# EAGLE design Fritzen_5110LCD_r00 (EAGLE 7.5.0)
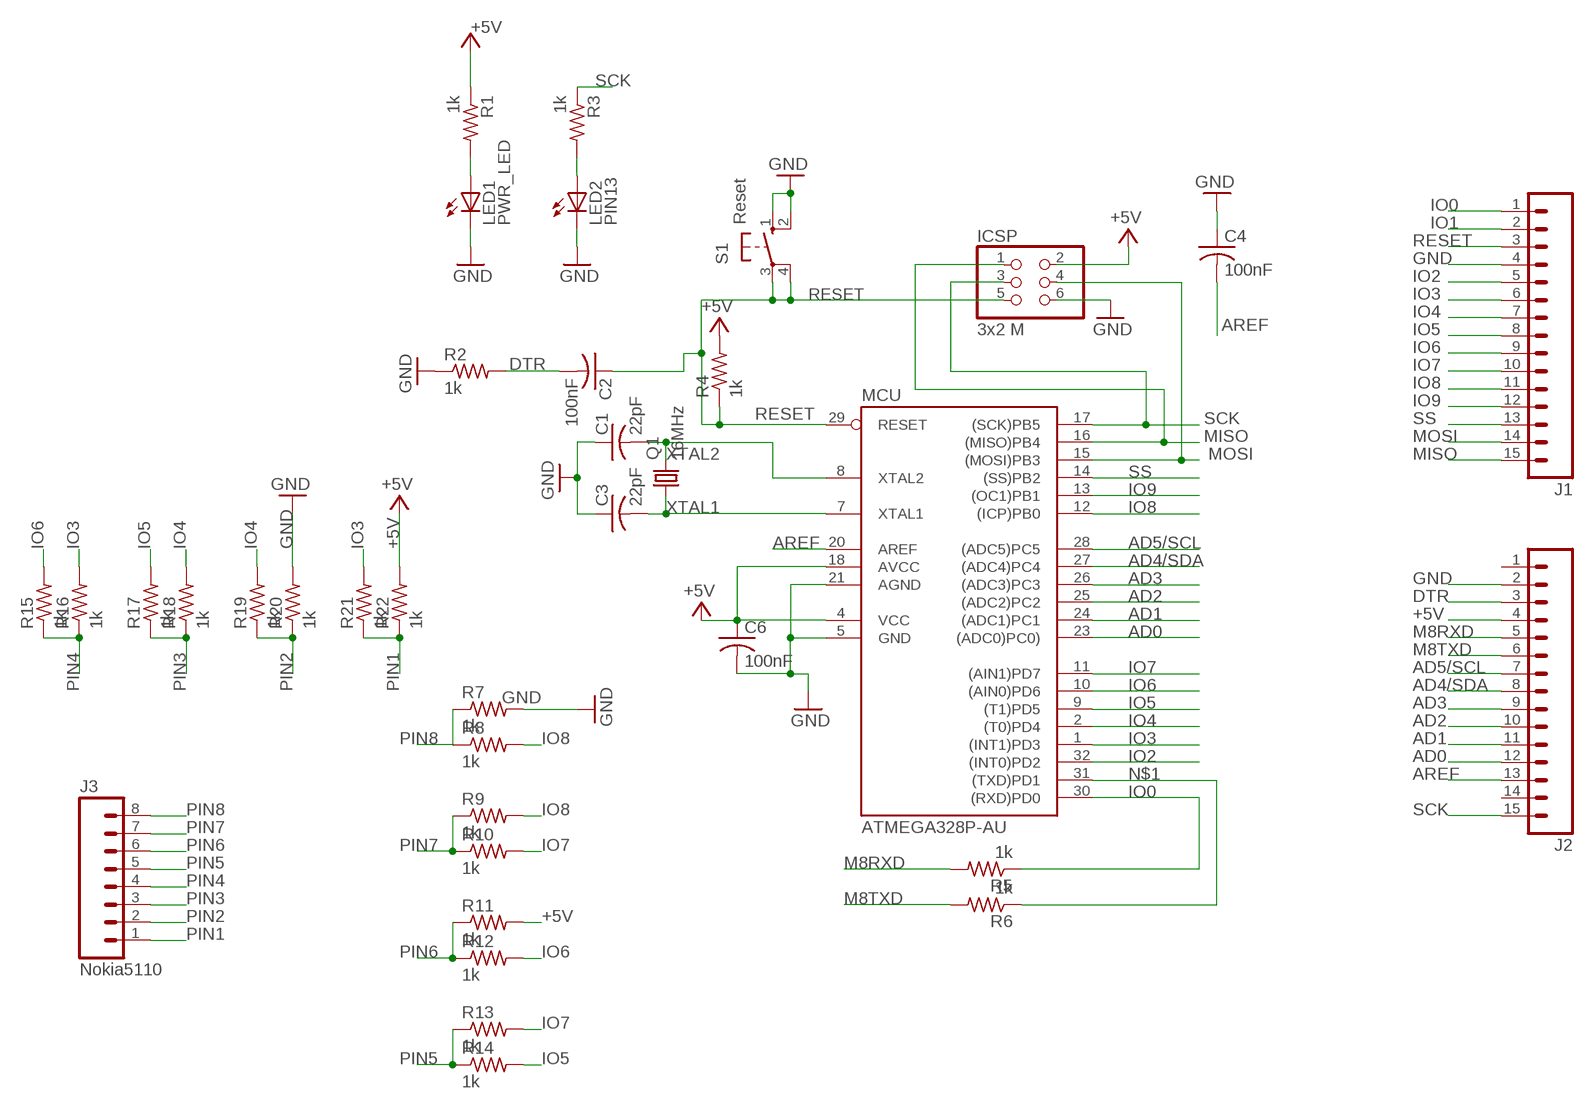
[diagram p0: schematic, sheet 1]

## Parts
C1  22pF  C-USC0805  [C0805]
C2  100nF  C-USC0805  [C0805]
C3  22pF  C-USC0805  [C0805]
C4  100nF  C-USC0805  [C0805]
C6  100nF  C-USC0805  [C0805]
ICSP  3x2 M  PINHD-2X3  [2X03]
J1  M15  [1X15]
J2  M15  [1X15]
J3  Nokia5110  M08SILK_FEMALE_PTH  [1X08]
LED1  PWR_LED  LEDCHIPLED_0805  [CHIPLED_0805]
LED2  PIN13  LEDCHIPLED_0805  [CHIPLED_0805]
MCU  ATMEGA328P-AU  [TQFP32-08]
Q1  16MHz  CRYSTALHC49S  [HC49/S]
R1  1k  R-US_M0805  [M0805]
R2  1k  R-US_M0805  [M0805]
R3  1k  R-US_M0805  [M0805]
R4  1k  R-US_M0805  [M0805]
R5  1k  R-US_M0805  [M0805]
R6  1k  R-US_M0805  [M0805]
R7  1k  R-US_M0805  [M0805]
R8  1k  R-US_M0805  [M0805]
R9  1k  R-US_M0805  [M0805]
R10  1k  R-US_M0805  [M0805]
R11  1k  R-US_M0805  [M0805]
R12  1k  R-US_M0805  [M0805]
R13  1k  R-US_M0805  [M0805]
R14  1k  R-US_M0805  [M0805]
R15  1k  R-US_M0805  [M0805]
R16  1k  R-US_M0805  [M0805]
R17  1k  R-US_M0805  [M0805]
R18  1k  R-US_M0805  [M0805]
R19  1k  R-US_M0805  [M0805]
R20  1k  R-US_M0805  [M0805]
R21  1k  R-US_M0805  [M0805]
R22  1k  R-US_M0805  [M0805]
S1  Reset  10-XX  [B3F-10XX]

## Nets
+5V [usbvcc]: C6.1 ICSP.2 J2.4 MCU.4(VCC) MCU.18(AVCC) R1.1 R4.2 R11.2 R22.2
AD0: J2.12 MCU.23((ADC0)PC0))
AD1: J2.11 MCU.24((ADC1)PC1)
AD2: J2.10 MCU.25((ADC2)PC2)
AD3: J2.9 MCU.26((ADC3)PC3)
AD4/SDA: J2.8 MCU.27((ADC4)PC4)
AD5/SCL: J2.7 MCU.28((ADC5)PC5)
AREF [aref]: C4.2 J2.13 MCU.20(AREF)
DTR: C2.2 J2.3 R2.2
GND [gnd]: C1.1 C3.1 C4.1 C6.2 ICSP.6 J1.4 J2.2 LED1.C LED2.C MCU.5(GND) MCU.21(AGND) R2.1 R7.2 R20.2 S1.1(S) S1.2(S1)
IO0: J1.1 MCU.30((RXD)PD0) R5.1
IO1: J1.2 R6.1
IO2: J1.5 MCU.32((INT0)PD2)
IO3: J1.6 MCU.1((INT1)PD3) R16.2 R21.2
IO4: J1.7 MCU.2((T0)PD4) R18.2 R19.2
IO5: J1.8 MCU.9((T1)PD5) R14.2 R17.2
IO6: J1.9 MCU.10((AIN0)PD6) R12.2 R15.2
IO7: J1.10 MCU.11((AIN1)PD7) R10.2 R13.2
IO8: J1.11 MCU.12((ICP)PB0) R8.2 R9.2
IO9: J1.12 MCU.13((OC1)PB1)
M8RXD: J2.5 R5.2
M8TXD: J2.6 R6.2
MISO: ICSP.1 J1.15 MCU.16((MISO)PB4)
MOSI: ICSP.4 J1.14 MCU.15((MOSI)PB3)
N$1: MCU.31((TXD)PD1)
N$2: LED2.A R3.2
N$3: LED1.A R1.2
PIN1: J3.1 R21.1 R22.1
PIN2: J3.2 R19.1 R20.1
PIN3: J3.3 R17.1 R18.1
PIN4: J3.4 R15.1 R16.1
PIN5: J3.5 R13.1 R14.1
PIN6: J3.6 R11.1 R12.1
PIN7: J3.7 R9.1 R10.1
PIN8: J3.8 R7.1 R8.1
RESET: C2.1 ICSP.5 J1.3 MCU.29(RESET) R4.1 S1.3(P) S1.4(P1)
SCK: ICSP.3 J2.15 MCU.17((SCK)PB5) R3.1
SS: J1.13 MCU.14((SS)PB2)
XTAL1: C3.2 MCU.7(XTAL1) Q1.1
XTAL2: C1.2 MCU.8(XTAL2) Q1.2
Unconnected: J2.1 J2.14

## Library data of the parts
C1-C4 C6 = adafruit:C-US: CAPACITOR, American symbol
ICSP = SmartPrj:PINHD-2X3: PIN HEADER
J1 J2 = SparkFun-Connectors:M15: Header 15 Standard 15-pin 0.1" header. Use with straight break away headers (SKU : PRT-00116), right angle break away headers (PRT-00553), swiss pins (PRT-00743), machine pins (PRT-00117), and female headers (PRT-00115).
J3 = SparkFun-Connectors:M08: Header 8 Standard 8-pin 0.1" header. Use with straight break away headers (SKU : PRT-00116), right angle break away headers (PRT-00553), swiss pins (PRT-00743), machine pins (PRT-00117), and female headers (PRT-00115).; PROD_ID: CONN-08438
LED1 LED2 = adafruit:LED: LED OSRAM: - CHIPLED LG R971, LG N971, LY N971, LG Q971, LY Q971, LO R971, LY R971 LH N974, LH R974 LS Q976, LO Q976, LY Q976 LO Q996 - Hyper CHIPLED LW Q18S LB Q993, LB Q99A, LB R99A - SideLED LS A670, LO A670, LY A670, LG A670, LP A670 LB A673, LV A673, LT A673, LW A673 LH A674 LY A675 LS A676, LA A676, LO A676, LY A676, LW A676 LS A679, LY A679, LG A679 - Hyper Micro SIDELED® LS Y876, LA Y876, LO Y876, LY Y876 LT Y87S - SmartLED LW L88C, LW L88S LB L89C, LB L89S, LG L890 LS L89K, LO L89K, LY L89K LS L896, LA L896, LO L896, LY L896 - TOPLED LS T670, LO T670, LY T670, LG T670, LP T670 LSG T670, LSP T670, LSY T670, LOP T670, LYG T670 LG T671, LOG T671, LSG T671 LB T673, LV T673, LT T673, LW T673 LH T674 LS T676, LA T676, LO T676, LY T676, LB T676, LH T676, LSB T676, LW T676 LB T67C, LV T67C, LT T67C, LS T67K, LO T67K, LY T67K, LW E67C LS E67B, LA E67B, LO E67B, LY E67B, LB E67C, LV E67C, LT E67C LW T67C LS T679, LY T679, LG T679 LS T770, LO T770, LY T770, LG T770, LP T770 LB T773, LV T773, LT T773, LW T773 LH T774 LS E675, LA E675, LY E675, LS T675 LS T776, LA T776, LO T776, LY T776, LB T776 LHGB T686 LT T68C, LB T68C - Hyper Mini TOPLED® LB M676 - Mini TOPLED Santana® LG M470 LS M47K, LO M47K, LY M47K Source: http://www.osram.convergy.de/
MCU = SmartPrj:ATMEGA328P-: MICROCONTROLLER 4 Kbytes FLASH 128 bytes SRAM 256 bytes EEPROM UART 6-channel 10 bit ADC
Q1 = crystal:CRYSTAL: CRYSTAL; OC_FARNELL: 1667008; OC_NEWARK: unknown
R1-R22 = adafruit:R-US_: RESISTOR, American symbol
S1 = switch-omron:10-XX: OMRON SWITCH; MPN: B3F-1000; OC_FARNELL: 176432; OC_NEWARK: 36M3542

## Net classes
0 default: width 0.254 mm, clearance 0.254 mm
1 power: width 0.61 mm, drill 0.61 mm, clearance 0.254 mm
2 gnd: width 0.305 mm, drill 0.559 mm, clearance 0.254 mm
3 usbvcc: width 0.508 mm, drill 0.61 mm, clearance 0.254 mm
4 aref: width 0.406 mm, drill 0.61 mm, clearance 0.254 mm

## Board
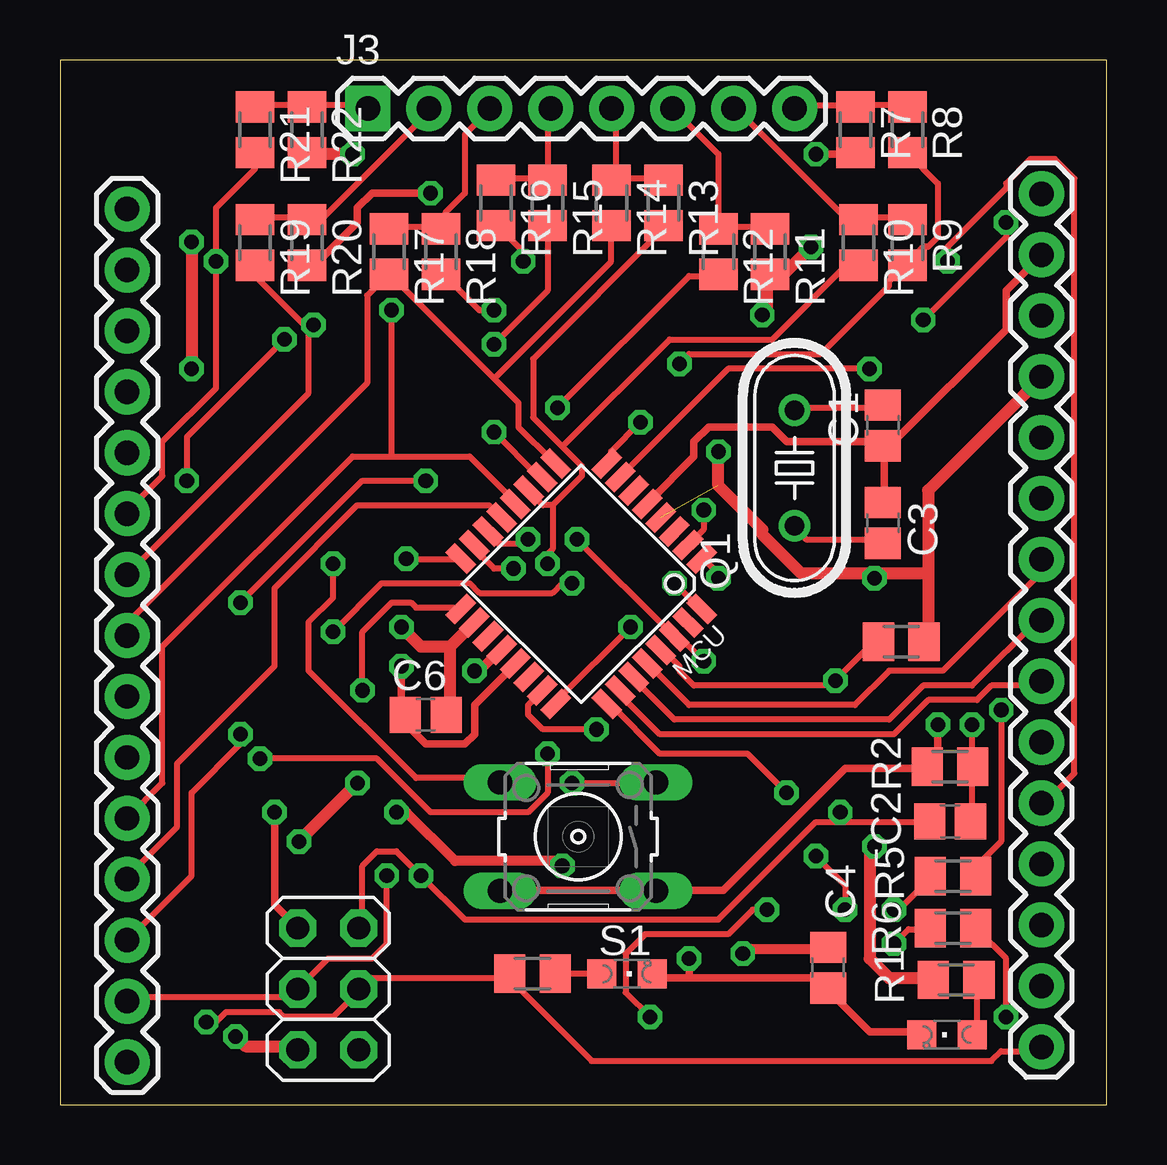
[diagram p1: board, top side]
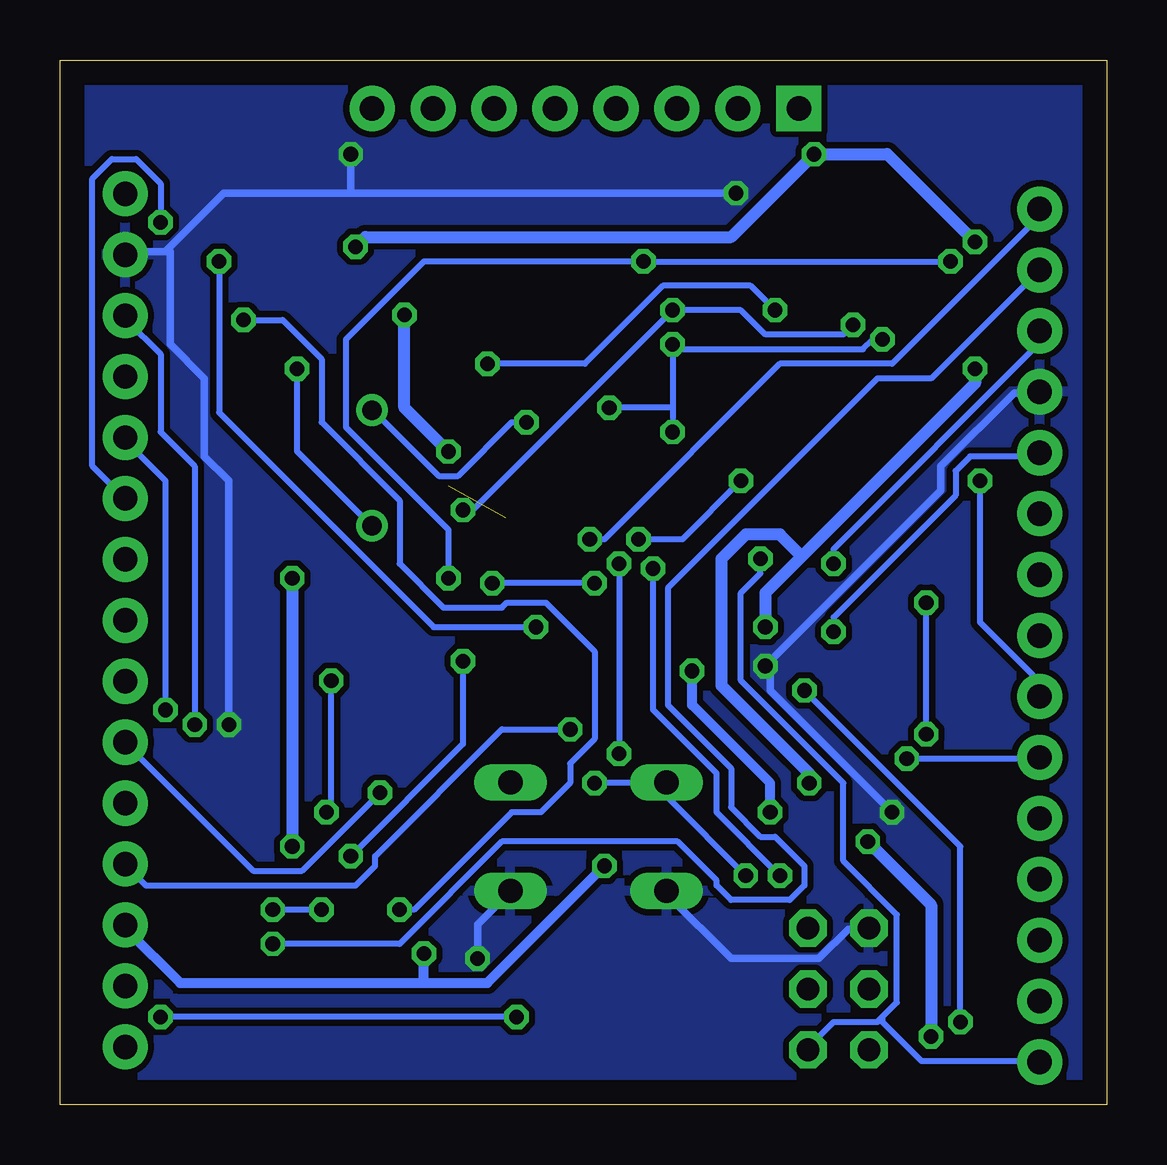
[diagram p2: board, bottom side, seen from below]

Size 43.61 x 43.55 mm. Coordinates in mm from the lower left corner, seen from the top.
Outline: 0,0 43.61,0 43.61,43.55 0,43.55 0,0
Copper layers (1*16): Top 0.035mm / dielectric 1.5mm / Bottom 0.035mm
Design rules "default": minimum track width 10mil, minimum drill 24mil, track to track 8mil, track to pad 8mil, pad to pad 8mil, via to via 8mil, smd to smd 8mil, copper to edge 40mil, drill to drill 8mil, minimum pad ring 10mil, minimum via ring 8mil, stop-mask expansion 4mil, vias tented up to drill 0mil, thermal gap 10mil

### Footprints (pad centres in the part's own frame; a part is rotated, then mirrored left to right if it is on the bottom)
C0805 = smd 1.3 x 1.5: 1 -0.85,0; 2 0.85,0
2X03 = drill 0.95 pad 1.55 octagon: 1 -2.54,-1.27; 2 -2.54,1.27; 3 0,-1.27; 4 0,1.27; 5 2.54,-1.27; 6 2.54,1.27
1X15 = drill 1.016 pad 1.88: 1 0,0; 2 2.54,0; 3 5.08,0; 4 7.62,0; 5 10.16,0; 6 12.7,0; 7 15.24,0; 8 17.78,0; 9 20.32,0; 10 22.86,0; 11 25.4,0; 12 27.94,0; 13 30.48,0; 14 33.02,0; 15 35.56,0
1X08 = drill 1.016 pad 1.88 square: 1 0,0 | drill 1.016 pad 1.88: 2 2.54,0; 3 5.08,0; 4 7.62,0; 5 10.16,0; 6 12.7,0; 7 15.24,0; 8 17.78,0
CHIPLED_0805 = smd 1.2 x 1.2: A 0,-1.05; C 0,1.05
TQFP32-08 = smd 1.27 x 0.559: 1 -4.293,2.8; 2 -4.293,2; 3 -4.293,1.2; 4 -4.293,0.4; 5 -4.293,-0.4; 6 -4.293,-1.2; 7 -4.293,-2; 8 -4.293,-2.8; 17 4.293,-2.8; 18 4.293,-2; 19 4.293,-1.2; 20 4.293,-0.4; 21 4.293,0.4; 22 4.293,1.2; 23 4.293,2; 24 4.293,2.8 | smd 0.559 x 1.27: 9 -2.8,-4.293; 10 -2,-4.293; 11 -1.2,-4.293; 12 -0.4,-4.293; 13 0.4,-4.293; 14 1.2,-4.293; 15 2,-4.293; 16 2.8,-4.293; 25 2.8,4.293; 26 2,4.293; 27 1.2,4.293; 28 0.4,4.293; 29 -0.4,4.293; 30 -1.2,4.293; 31 -2,4.293; 32 -2.8,4.293
HC49/S = drill 0.813: 1 -2.413,0; 2 2.413,0
M0805 = smd 1.3 x 1.6: 1 -0.95,0; 2 0.95,0
B3F-10XX = drill 1.016 long: 1 -3.251,2.261; 2 3.251,2.261; 3 -3.251,-2.261; 4 3.251,-2.261

### Placement (x,y rotation side)
C1  34.29,28.32 90 top
C2  37.08,11.81 0 top
C3  34.29,24.26 270 top
C4  32,5.71 90 top
C6  15.24,16.26 180 top
ICSP  11.18,4.83 90 top
J1  2.79,37.34 270 top
J2  40.89,37.97 270 top
J3  12.83,41.53 0 top
LED1  36.96,2.92 90 top
LED2  23.62,5.46 270 top
MCU  21.72,21.72 225 top
Q1  30.61,26.54 90 top
R1  37.34,5.21 0 top
R2  37.08,14.1 0 top
R3  19.68,5.46 0 top
R4  35.05,19.3 0 top
R5  37.21,9.53 0 top
R6  37.21,7.37 0 top
R7  33.15,40.64 270 top
R8  35.31,40.64 270 top
R9  35.31,35.94 270 top
R10  33.27,35.94 270 top
R11  29.59,35.56 270 top
R12  27.43,35.56 270 top
R13  25.15,37.59 270 top
R14  22.99,37.59 270 top
R15  20.32,37.59 270 top
R16  18.16,37.59 270 top
R17  13.72,35.56 270 top
R18  15.88,35.56 270 top
R19  8.13,35.94 270 top
R20  10.29,35.94 270 top
R21  8.13,40.64 270 top
R22  10.29,40.64 270 top
S1  21.59,11.18 180 top

### Tracks (layer width: path | path; a pad name or v marks a point on that pad's centre or on a via)
+5V  (via drill 0.61)  (1 unrouted)
  Top 0.508: 16.26,19.1 17.07,19.91 MCU.18 | 16.26,19.1 16.26,16.26 C6.1 | 36.17,22.15 36.17,25.6 40.84,30.28 J2.4 | 36.17,22.15 36.17,19.3 R4.2 | v29.26,32.92 29.46,33.12 29.46,34.54 R11.2 29.67,34.75 30.28,34.75 v31.29,35.76 | v27.43,27.23 27.43,25.81 29.26,23.98 29.26,23.77 30.89,22.15 33.93,22.15 | 36.17,22.15 33.93,22.15 | v12.19,39.62 10.36,39.62 R22.2 | v33.93,10.77 33.73,10.57 33.73,6.1 34.54,5.28 36.37,5.28 R1.1 | v33.93,21.95 33.93,22.15 | 16.26,19.1 15.04,19.1 v14.22,19.91 | v5.49,35.97 v5.49,30.68 | v7.32,2.85 7.72,2.44 9.75,2.44 ICSP.2 | v12.39,13.41 v9.96,10.97
  Bottom 0.508: v29.26,32.92 29.26,29.06 v27.43,27.23 | v31.29,35.76 30.89,36.17 15.65,36.17 v12.19,39.62 9.14,39.62 v5.49,35.97 | v33.93,21.95 v33.93,10.77 | v14.22,19.91 14.22,21.34 12.7,22.86 | 12.7,22.86 5.49,30.07 v5.49,30.68 | v7.32,2.85 7.32,8.33 v9.96,10.97 | v12.39,13.41 12.39,13.82 16.05,17.48 16.05,22.76 15.04,23.77 13.61,23.77 12.7,22.86
AD0  (via drill 0.61)
  Top 0.254: v22.35,15.65 20.12,15.65 19.51,16.26 19.51,16.66 19.91,17.07 MCU.23
  Bottom 0.254: v22.35,15.65 25.2,15.65 30.48,10.36 30.48,9.96 31.29,9.14 40.03,9.14 40.84,9.96 J2.12
AD1  (via drill 0.61)
  Top 0.254: v23.77,19.91 20.73,16.87 MCU.24 | v36.98,35.15 36.98,35.76 39.42,38.2 39.42,38.41 40.44,39.42 41.45,39.42 42.27,38.61 42.27,13.82 41.05,12.6 J2.11
  Bottom 0.254: v23.77,19.91 28.04,19.91 36.98,28.85 v36.98,35.15
AD2  (via drill 0.61)
  Top 0.254: v30.28,13.01 28.65,14.63 24.99,14.63 22.96,16.66 MCU.25
  Bottom 0.254: v30.28,13.01 33.53,9.75 35.56,9.75 40.84,15.04 J2.10
AD3
  Top 0.254: MCU.26 23.37,17.07 24.99,15.44 34.75,15.44 36.17,16.87 38.2,16.87 38.81,17.48 40.84,17.48 J2.9
AD4/SDA
  Top 0.254: MCU.27 23.98,17.68 25.6,16.05 34.54,16.05 35.97,17.48 38,17.48 40.84,20.32 J2.8
AD5/SCL
  Top 0.254: MCU.28 24.59,18.29 26.21,16.66 33.12,16.66 34.54,18.09 36.78,18.09 40.84,22.15 40.84,22.55 J2.7
AREF  (via drill 0.61)
  Top 0.406: v17.27,18.09 17.48,18.09 18.29,18.9 MCU.20 | v14.02,12.19 14.43,12.19 16.46,10.16 20.73,10.16 v20.93,9.96 | v28.45,6.3 28.65,6.5 31.9,6.5 C4.2
  Bottom 0.406: v17.27,18.09 17.27,16.66 14.02,13.41 v14.02,12.19 | v20.93,9.96 25.81,5.08 28.45,5.08 | 28.45,5.08 38.61,5.08 40.84,7.32 J2.13 | 28.45,5.08 v28.45,6.3
DTR  (via drill 0.61)
  Top 0.254: C2.2 38,11.99 38,14.02 R2.2 38,14.22 v38,15.85
  Bottom 0.254: v38,15.85 38,26.62 39.42,28.04 39.42,31.29 40.84,32.72 J2.3
GND  (via drill 0.61)
  Top 0.305: MCU.5 24.59,25.2 26.42,27.03 26.42,27.64 27.03,28.25 29.67,28.25 30.28,27.64 34.14,27.64 C1.1 | C3.1 34.34,25.2 34.34,27.43 C1.1 | v15.44,38 13.01,38 12.39,37.39 12.39,36.78 10.77,35.15 10.36,35.15 R20.2 | v31.5,39.62 33.12,39.62 R7.2 | C1.1 34.34,27.64 34.75,27.64 39.42,32.31 39.42,33.93 40.84,35.36 J2.2 | MCU.21 18.9,18.29 17.27,16.66 17.27,15.44 16.87,15.04 15.24,15.04 14.43,15.85 14.43,16.26 C6.2 14.22,16.26 v14.22,18.29 | 26.21,5.28 31.5,5.28 31.9,4.88 C4.1 32.11,4.67 33.73,3.05 35.76,3.05 LED1.C | 26.21,5.28 24.79,5.28 LED2.C | S1.2 18.49,8.94 24.79,8.94 S1.1 24.99,8.94 27.64,8.94 32.72,14.02 35.97,14.02 R2.1 36.17,14.22 36.58,14.63 v36.58,15.85 | v26.21,6.1 26.21,5.28 | v8.94,12.19 8.94,8.33 ICSP.6
  Bottom 0.305: 31.5,38 36.78,38 39.12,35.66 | 31.5,38 v15.44,38 | 39.12,35.66 39.22,35.56 40.84,35.56 J2.2 | 31.5,38 v31.5,39.62 | J1.4 2.85,29.67 3.86,29.67 6.91,26.62 6.91,25.6 v14.22,18.29 14.02,18.29 14.02,17.27 v8.94,12.19 | ICSP.6 9.96,7.32 10.77,7.32 11.99,6.1 15.65,6.1 18.29,8.74 S1.2 | v26.21,6.1 26.21,7.52 24.99,8.74 S1.1 | v36.58,15.85 36.58,26.01 37.59,27.03 37.59,30.28 39.01,31.7 39.01,35.56 39.12,35.66
  pour Bottom: 0,0 43.56,0 43.56,43.56 0,43.56
IO0  (via drill 0.61)
  Top 0.254: v21.54,23.57 25.4,19.71 MCU.30 25.6,19.71 v26.82,18.49 | v34.75,8.13 34.95,8.13 36.17,9.35 R5.1 | v32.72,8.13 32.72,9.14 v31.5,10.36
  Bottom 0.254: v21.54,23.57 20.93,23.57 13.61,30.89 8.94,30.89 2.64,37.19 J1.1 | v32.72,8.13 v34.75,8.13 | v31.5,10.36 26.82,15.04 v26.82,18.49
IO1  (via drill 0.61)
  Top 0.254: v34.75,6.71 35.36,7.32 36.17,7.32 R6.1
  Bottom 0.254: v34.75,6.71 29.46,6.71 25.2,10.97 17.88,10.97 16.26,9.35 16.26,9.14 15.65,8.53 13.21,8.53 12.6,9.14 12.6,9.96 13.82,11.18 14.43,11.18 15.65,12.39 15.65,14.02 18.29,16.66 18.29,21.54 9.55,30.28 7.32,30.28 J1.2
IO2  (via drill 0.61)
  Top 0.254: v25.6,21.74 26.62,20.73 MCU.32 | v21.34,21.74 20.93,21.74 20.52,21.34 17.48,21.34 17.07,21.74 13.41,21.74 v11.38,19.71
  Bottom 0.254: v21.34,21.74 v25.6,21.74 | v11.38,19.71 11.38,20.32 6.3,25.4 6.3,26.42 5.69,27.03 2.85,27.03 J1.5
IO3  (via drill 0.61)
  Top 0.254: R21.2 8.13,39.01 6.5,37.39 v6.5,35.15 6.5,29.87 4.27,27.64 4.27,26.21 2.85,24.79 J1.6 | v27.43,21.95 27.43,22.15 26.82,22.76 MCU.1 | v19.3,35.15 19.3,35.56 18.29,36.58 R16.2
  Bottom 0.254: v27.43,21.95 27.43,23.98 31.7,28.25 31.7,31.9 28.45,35.15 v19.3,35.15 v6.5,35.15
IO4  (via drill 0.61)
  Top 0.254: v26.82,24.79 26.82,23.98 26.21,23.37 MCU.2 | v18.09,33.12 17.48,33.12 16.05,34.54 R18.2 | R19.2 8.13,34.54 10.36,32.31 | 10.36,32.31 10.36,29.67 J1.7 | 10.36,32.31 v10.57,32.51
  Bottom 0.254: v26.82,24.79 26.42,24.79 v18.09,33.12 15.24,33.12 14.22,32.11 10.97,32.11 v10.57,32.51
IO5
  Top 0.254: 18.09,30.28 13.82,34.54 R17.2 13.61,34.54 12.8,33.73 12.8,30.07 2.85,20.12 2.85,19.71 J1.8 | 18.09,30.28 19.1,29.26 19.1,28.25 20.52,26.82 MCU.9 | 18.09,30.28 22.96,35.15 22.96,36.58 R14.2
IO6  (via drill 0.61)
  Top 0.254: v18.09,28.04 19.91,26.21 MCU.10 | v18.09,31.7 20.32,33.93 R15.2 | v20.73,29.06 26.21,34.54 27.43,34.54 R12.2 | v5.28,26.01 5.28,27.84 v9.35,31.9
  Bottom 0.254: 18.09,31.5 18.09,29.06 | 18.09,29.06 v18.09,28.04 | 18.09,29.06 v20.73,29.06 | v5.28,26.01 5.28,20.12 2.85,17.68 2.85,17.07 J1.9 | v9.35,31.9 9.75,31.9 10.16,31.5 18.09,31.5 | 18.09,31.5 v18.09,31.7
IO7  (via drill 0.61)
  Top 0.254: 20.52,24.99 20.12,24.99 19.71,25.4 MCU.11 | 20.52,24.99 21.74,26.21 21.74,26.62 20.93,27.43 | 20.93,27.43 19.71,28.65 19.71,31.09 25.2,36.58 R13.2 | 20.93,27.43 25.4,31.9 29.67,31.9 32.72,34.95 33.12,34.95 R10.2 | v8.33,14.43 13.21,14.43 15.44,12.19 19.51,12.19 20.32,13.01 v20.32,14.63 | v20.32,22.55 20.32,22.96 20.52,23.16 20.52,24.99
  Bottom 0.254: v8.33,14.43 2.85,14.43 J1.10 | v20.32,22.55 v20.32,14.63
IO8  (via drill 0.61)
  Top 0.254: R8.2 35.36,39.62 36.58,38.41 36.58,36.17 36.17,35.76 35.97,35.76 35.36,35.15 R9.2 35.15,34.95 34.54,34.34 34.54,34.14 31.7,31.29 26.21,31.29 v25.81,30.89 | 13.82,27.03 12.19,27.03 4.27,19.1 4.27,13.41 J1.11 | 13.82,27.03 17.07,27.03 18.9,25.2 MCU.12 | 13.82,27.03 v13.82,33.12
  Bottom 0.254: v25.81,30.89 21.74,30.89 18.49,34.14 14.83,34.14 v13.82,33.12
IO9
  Top 0.254: MCU.13 18.29,24.59 17.88,24.99 12.39,24.99 8.94,21.54 8.94,18.29 4.88,14.22 4.88,11.58 2.85,9.55 J1.12
M8RXD  (via drill 0.61)
  Top 0.254: v39.22,16.46 39.22,10.97 38.2,9.96 38.2,9.55 R5.2
  Bottom 0.254: v39.22,16.46 39.22,26.01 40.84,27.64 J2.5
M8TXD  (via drill 0.61)
  Top 0.254: v39.42,3.66 39.42,6.1 38.2,7.32 R6.2 | v24.59,3.66 23.57,4.67 23.57,6.3 24.38,7.11 27.84,7.11 28.85,8.13 v29.46,8.13 | v35.97,32.72 39.42,36.17 v39.42,36.78
  Bottom 0.254: v24.59,3.66 v39.42,3.66 | v29.46,8.13 28.85,8.13 24.79,12.19 23.57,12.19 22.35,13.41 22.35,14.22 21.34,15.24 21.34,18.9 23.37,20.93 24.99,20.93 25.2,20.73 27.64,20.73 29.46,22.55 29.46,25.2 32.72,28.45 32.72,31.09 34.34,32.72 v35.97,32.72 | v39.42,36.78 39.42,38.41 40.44,39.42 41.45,39.42 42.27,38.61 42.27,26.62 41.05,25.4 J2.6
MISO  (via drill 0.61)
  Top 0.254: v14.43,22.76 16.66,22.76 MCU.16
  Bottom 0.254: v14.43,22.76 14.43,22.15 15.24,21.34 15.24,17.68 10.97,13.41 10.97,10.16 8.74,7.92 8.74,4.27 9.35,3.66 | 9.35,3.66 9.55,3.45 11.38,3.45 12.39,2.44 ICSP.1 | 9.35,3.66 9.35,3.45 7.72,1.83 2.85,1.83 J1.15
MOSI  (via drill 0.61)
  Top 0.254: v18.9,22.35 18.09,22.35 17.27,23.16 MCU.15 | v13.61,9.55 13.61,6.71 13.01,6.1 11.18,6.1 ICSP.4 9.55,4.47 2.85,4.47 J1.14
  Bottom 0.254: v18.9,22.35 18.9,16.46 16.26,13.82 16.26,12.19 v13.61,9.55
N$2
  Top 0.254: LED2.A 22.55,5.49 20.73,5.49 R3.2
N$3
  Top 0.254: LED1.A 38.2,3.05 38.2,5.08 R1.2
PIN1
  Top 0.254: R21.1 8.13,41.66 10.16,41.66 R22.1 10.36,41.66 12.8,41.66 J3.1
PIN2
  Top 0.254: R19.1 8.13,36.98 10.16,36.98 R20.1 10.36,36.98 10.97,36.98 15.44,41.45 J3.2
PIN3
  Top 0.254: R17.1 13.82,36.58 15.85,36.58 R18.1 16.05,36.58 16.05,37.19 16.87,38 16.87,40.44 17.88,41.45 J3.3
PIN4
  Top 0.254: 20.32,38.61 18.29,38.61 R16.1 | 20.32,38.61 20.32,41.45 J3.4 | 20.32,38.61 R15.1
PIN5
  Top 0.254: 23.16,38.61 24.99,38.61 R13.1 | 23.16,38.61 23.16,41.45 J3.5 | 23.16,38.61 R14.1
PIN6
  Top 0.254: 27.43,36.58 29.46,36.58 R11.1 | 27.43,36.58 27.43,39.62 J3.6 | 27.43,36.58 R12.1
PIN7
  Top 0.254: R9.1 35.15,36.98 33.33,36.98 R10.1 33.12,36.98 32.72,36.98 28.25,41.45 J3.7
PIN8
  Top 0.254: R8.1 35.15,41.66 33.33,41.66 R7.1 33.12,41.66 30.68,41.66 J3.8
RESET  (via drill 0.61)
  Top 0.254: MCU.29 25.2,18.9 25.81,18.29 25.81,18.09 26.42,17.48 32.11,17.48 v32.31,17.68 33.93,19.3 R4.1 | 32.51,11.79 31.5,11.79 27.43,7.72 16.87,7.72 v15.04,9.55 14.02,10.57 13.21,10.57 12.6,9.96 12.6,7.52 ICSP.5 | 32.51,11.79 36.17,11.79 C2.1 | v21.34,13.41 24.79,13.41 S1.3 | v11.38,22.55 11.38,21.13 10.36,20.12 10.36,18.09 14.83,13.61 18.29,13.61 S1.4 | 32.51,11.79 v32.51,12.19
  Bottom 0.254: v15.04,9.55 18.29,12.8 18.29,13.41 S1.4 18.49,13.41 v21.34,13.41 | v11.38,22.55 11.38,23.16 2.85,31.7 2.85,32.11 J1.3 | v32.31,17.68 32.31,12.39 v32.51,12.19
SCK  (via drill 0.61)
  Top 0.254: v12.6,17.27 12.6,19.71 13.82,20.93 14.63,20.93 14.83,20.73 16.66,20.73 MCU.17 | v6.1,3.45 6.5,3.45 6.91,3.86 9.14,3.86 9.35,3.66 11.38,3.66 12.39,4.67 ICSP.3 12.6,4.88 13.01,5.28 18.69,5.28 | 18.69,5.28 22.15,1.83 38.81,1.83 39.22,2.23 40.84,2.23 J2.15 | 18.69,5.28 R3.1
  Bottom 0.254: v12.6,17.27 6.1,10.77 v6.1,3.45
SS  (via drill 0.61)
  Top 0.254: v19.51,23.57 19.3,23.37 18.29,23.37 17.88,23.77 MCU.14 | v15.24,26.01 12.6,26.01 v7.52,20.93 | v7.52,15.44 7.52,15.04 5.49,13.01 5.49,9.55 J1.13
  Bottom 0.254: v19.51,23.57 17.68,23.57 v15.24,26.01 | v7.52,15.44 v7.52,20.93
XTAL1  (via drill 0.61)
  Top 0.254: v33.73,30.68 27.84,30.68 23.37,26.21 MCU.7 | C3.2 34.14,23.57 31.09,23.57 30.68,23.98 Q1.1
  Bottom 0.254: v33.73,30.68 33.73,27.23 30.68,24.18 Q1.1
XTAL2  (via drill 0.61)
  Top 0.254: v24.18,28.45 22.96,27.23 22.96,26.82 MCU.8 | C1.2 34.14,29.06 30.68,29.06 Q1.2
  Bottom 0.254: v24.18,28.45 24.79,28.45 27.03,26.21 27.84,26.21 30.48,28.85 Q1.2